# Altium schematic sheet Low_MOS.SchDoc: Low_MOS
size A4; Organization: Altium Limited; Address1: L3, 12a Rodborough Rd; Address2: Frenchs Forest; Address3: NSW; Address4: Australia 2086; DocumentNumber: 8; SheetNumber: 8; SheetTotal: 8
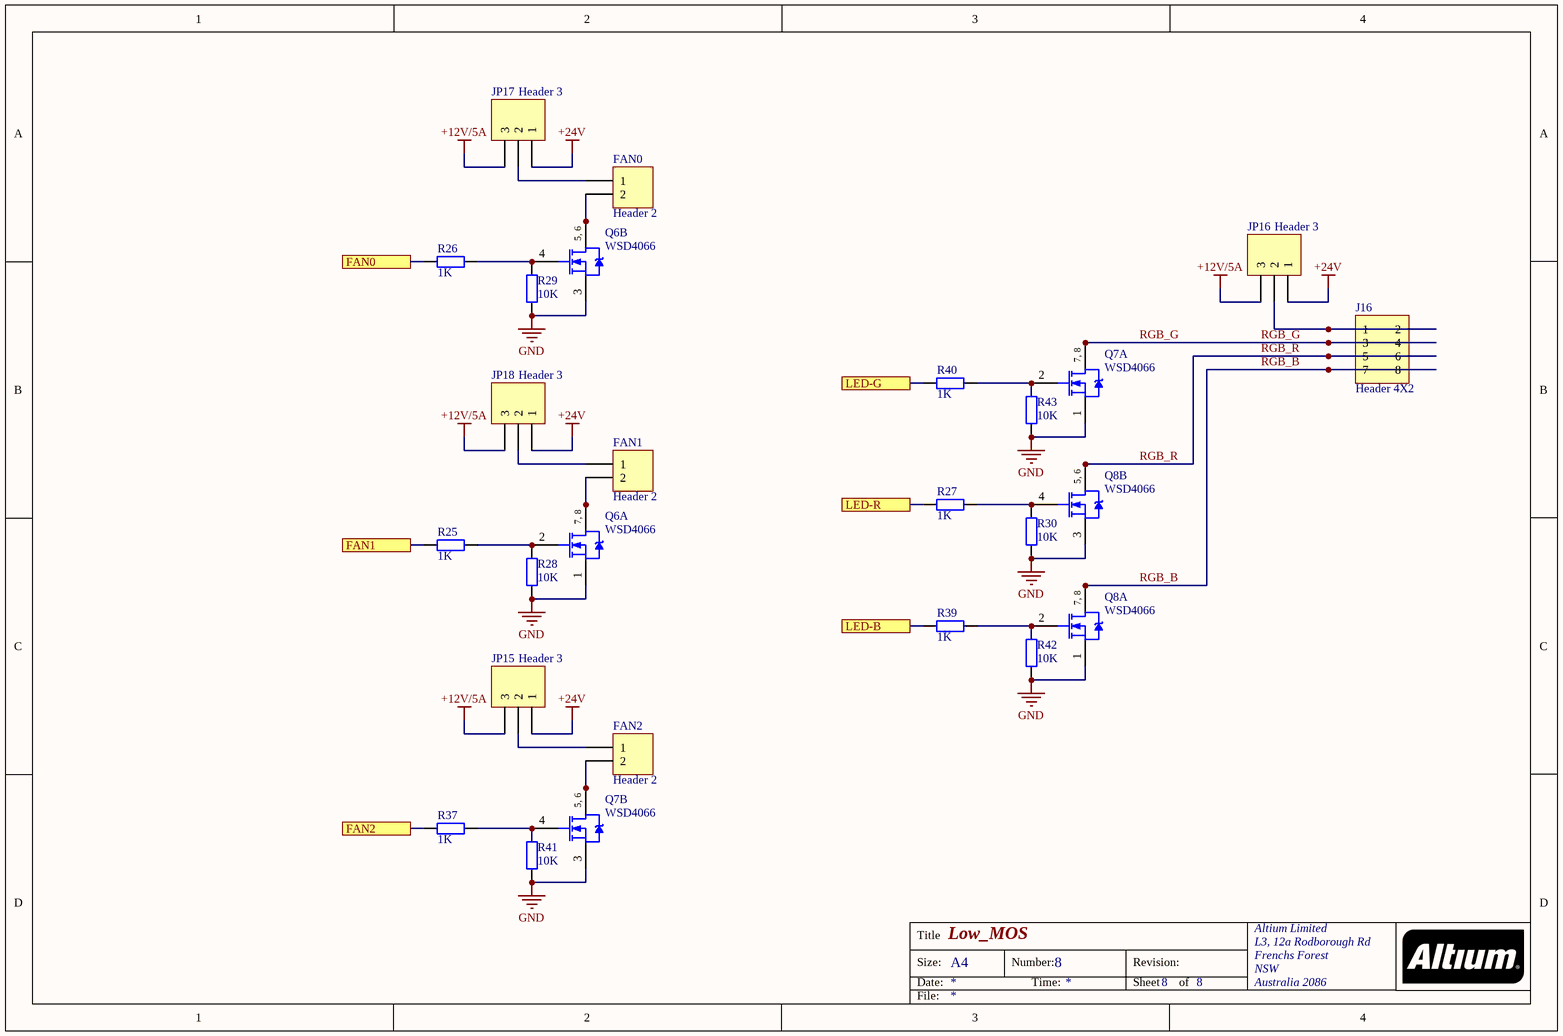
[diagram p0: Low_MOS.SchDoc]

## Parts
FAN0  Header 2  [1X2 MTE STRAIGHT HEADER 2.54MM]
FAN1  Header 2  [1X2 MTE STRAIGHT HEADER 2.54MM]
FAN2  Header 2  [1X2 MTE STRAIGHT HEADER 2.54MM]
J16  Header 4X2  [Header 2X4]
JP15  Header 3  [Header 1X3]
JP16  Header 3  [Header 1X3]
JP17  Header 3  [Header 1X3]
JP18  Header 3  [Header 1X3]
Q6  WSD4066  [DFN3X3-8L-Dual]  (parts A,B of 2)
Q7  WSD4066  [DFN3X3-8L-Dual]  (parts A,B of 2)
Q8  WSD4066  [DFN3X3-8L-Dual]  (parts A,B of 2)
R25  1K  [RES0402]
R26  1K  [RES0402]
R27  1K  [RES0402]
R28  10K  [RES0402]
R29  10K  [RES0402]
R30  10K  [RES0402]
R37  1K  [RES0402]
R39  1K  [RES0402]
R40  1K  [RES0402]
R41  10K  [RES0402]
R42  10K  [RES0402]
R43  10K  [RES0402]

## Ports
FAN0, FAN1, FAN2, LED-B, LED-G, LED-R

## Nets
+12V/5A: JP15.3 JP16.3 JP17.3 JP18.3
+24V: JP15.1 JP16.1 JP17.1 JP18.1
GND: Q6.1(S) Q6.3(S) Q7.1(S) Q7.3(S) Q8.1(S) Q8.3(S) R28.2 R29.2 R30.2 R41.2 R42.2 R43.2
FAN0: R26.1 ; port FAN0
FAN1: R25.1 ; port FAN1
FAN2: R37.1 ; port FAN2
LED-B: R39.1 ; port LED-B
LED-G: R40.1 ; port LED-G
LED-R: R27.1 ; port LED-R
RGB_B: J16.7 J16.8 Q8.7(D) Q8.8(D)
RGB_G: J16.3 J16.4 Q7.7(D) Q7.8(D)
RGB_R: J16.5 J16.6 Q8.5(D) Q8.6(D)
NetFAN0_1: FAN0.1 JP17.2
NetFAN0_2: FAN0.2 Q6.5(D) Q6.6(D)
NetFAN1_1: FAN1.1 JP18.2
NetFAN1_2: FAN1.2 Q6.7(D) Q6.8(D)
NetFAN2_1: FAN2.1 JP15.2
NetFAN2_2: FAN2.2 Q7.5(D) Q7.6(D)
NetJ16_1: J16.1 J16.2 JP16.2
NetQ6_2: Q6.2(G) R25.2 R28.1
NetQ6_4: Q6.4(G) R26.2 R29.1
NetQ7_2: Q7.2(G) R40.2 R43.1
NetQ7_4: Q7.4(G) R37.2 R41.1
NetQ8_2: Q8.2(G) R39.2 R42.1
NetQ8_4: Q8.4(G) R27.2 R30.1

## Notes on the sheet
- Title
- Size:
- Date:
- A4
- Number:
- Time:
- Revision:
- Sheet
- of
- File:
- (in symbol IRF7103, part A) 7, 8
- (in symbol IRF7103, part B) 5, 6

## Library data of the parts
FAN0-FAN2 = Header 2: Header, 2-Pin; LatestRevisionDate: 17-Jul-2002; LatestRevisionNote: Re-released for DXP Platform.; Publisher: Altium Limited
J16 = Header 4X2: Header, 4-Pin, Dual row; LatestRevisionDate: 17-Jul-2002; LatestRevisionNote: Re-released for DXP Platform.; Publisher: Altium Limited
JP15-JP18 = Header 3: Header, 3-Pin; LatestRevisionDate: 17-Jul-2002; LatestRevisionNote: Re-released for DXP Platform.; Publisher: Altium Limited
Q6-Q8 = IRF7103: HEXFET Power MOSFET; Published: 8-Jun-2000; LatestRevisionDate: 13-Apr-2006; LatestRevisionNote: IPC-7351 Footprint Added.; DatasheetVersion: Aug-1997; PackageVersion: Feb-2001; PackageReference: SO-8; Publisher: Altium Limited; PackageDescription: 8-Pin Plastic Small Outline Integrated Circuit 1.27 mm Pitch; Code_JEDEC: MS-012-AA; Code_IPC: SOIC127P600-8; ComponentLink1Description: Manufacturer Link; ComponentLink1URL: http://www.irf.com/; ComponentLink2Description: Datasheet; ComponentLink2URL: http://www.irf.com/product-info/datasheets/data/irf7103.pdf
R25-R30 R37 R39-R43 = Resistor